# Altium schematic sheet Registers.SchDoc
size A3
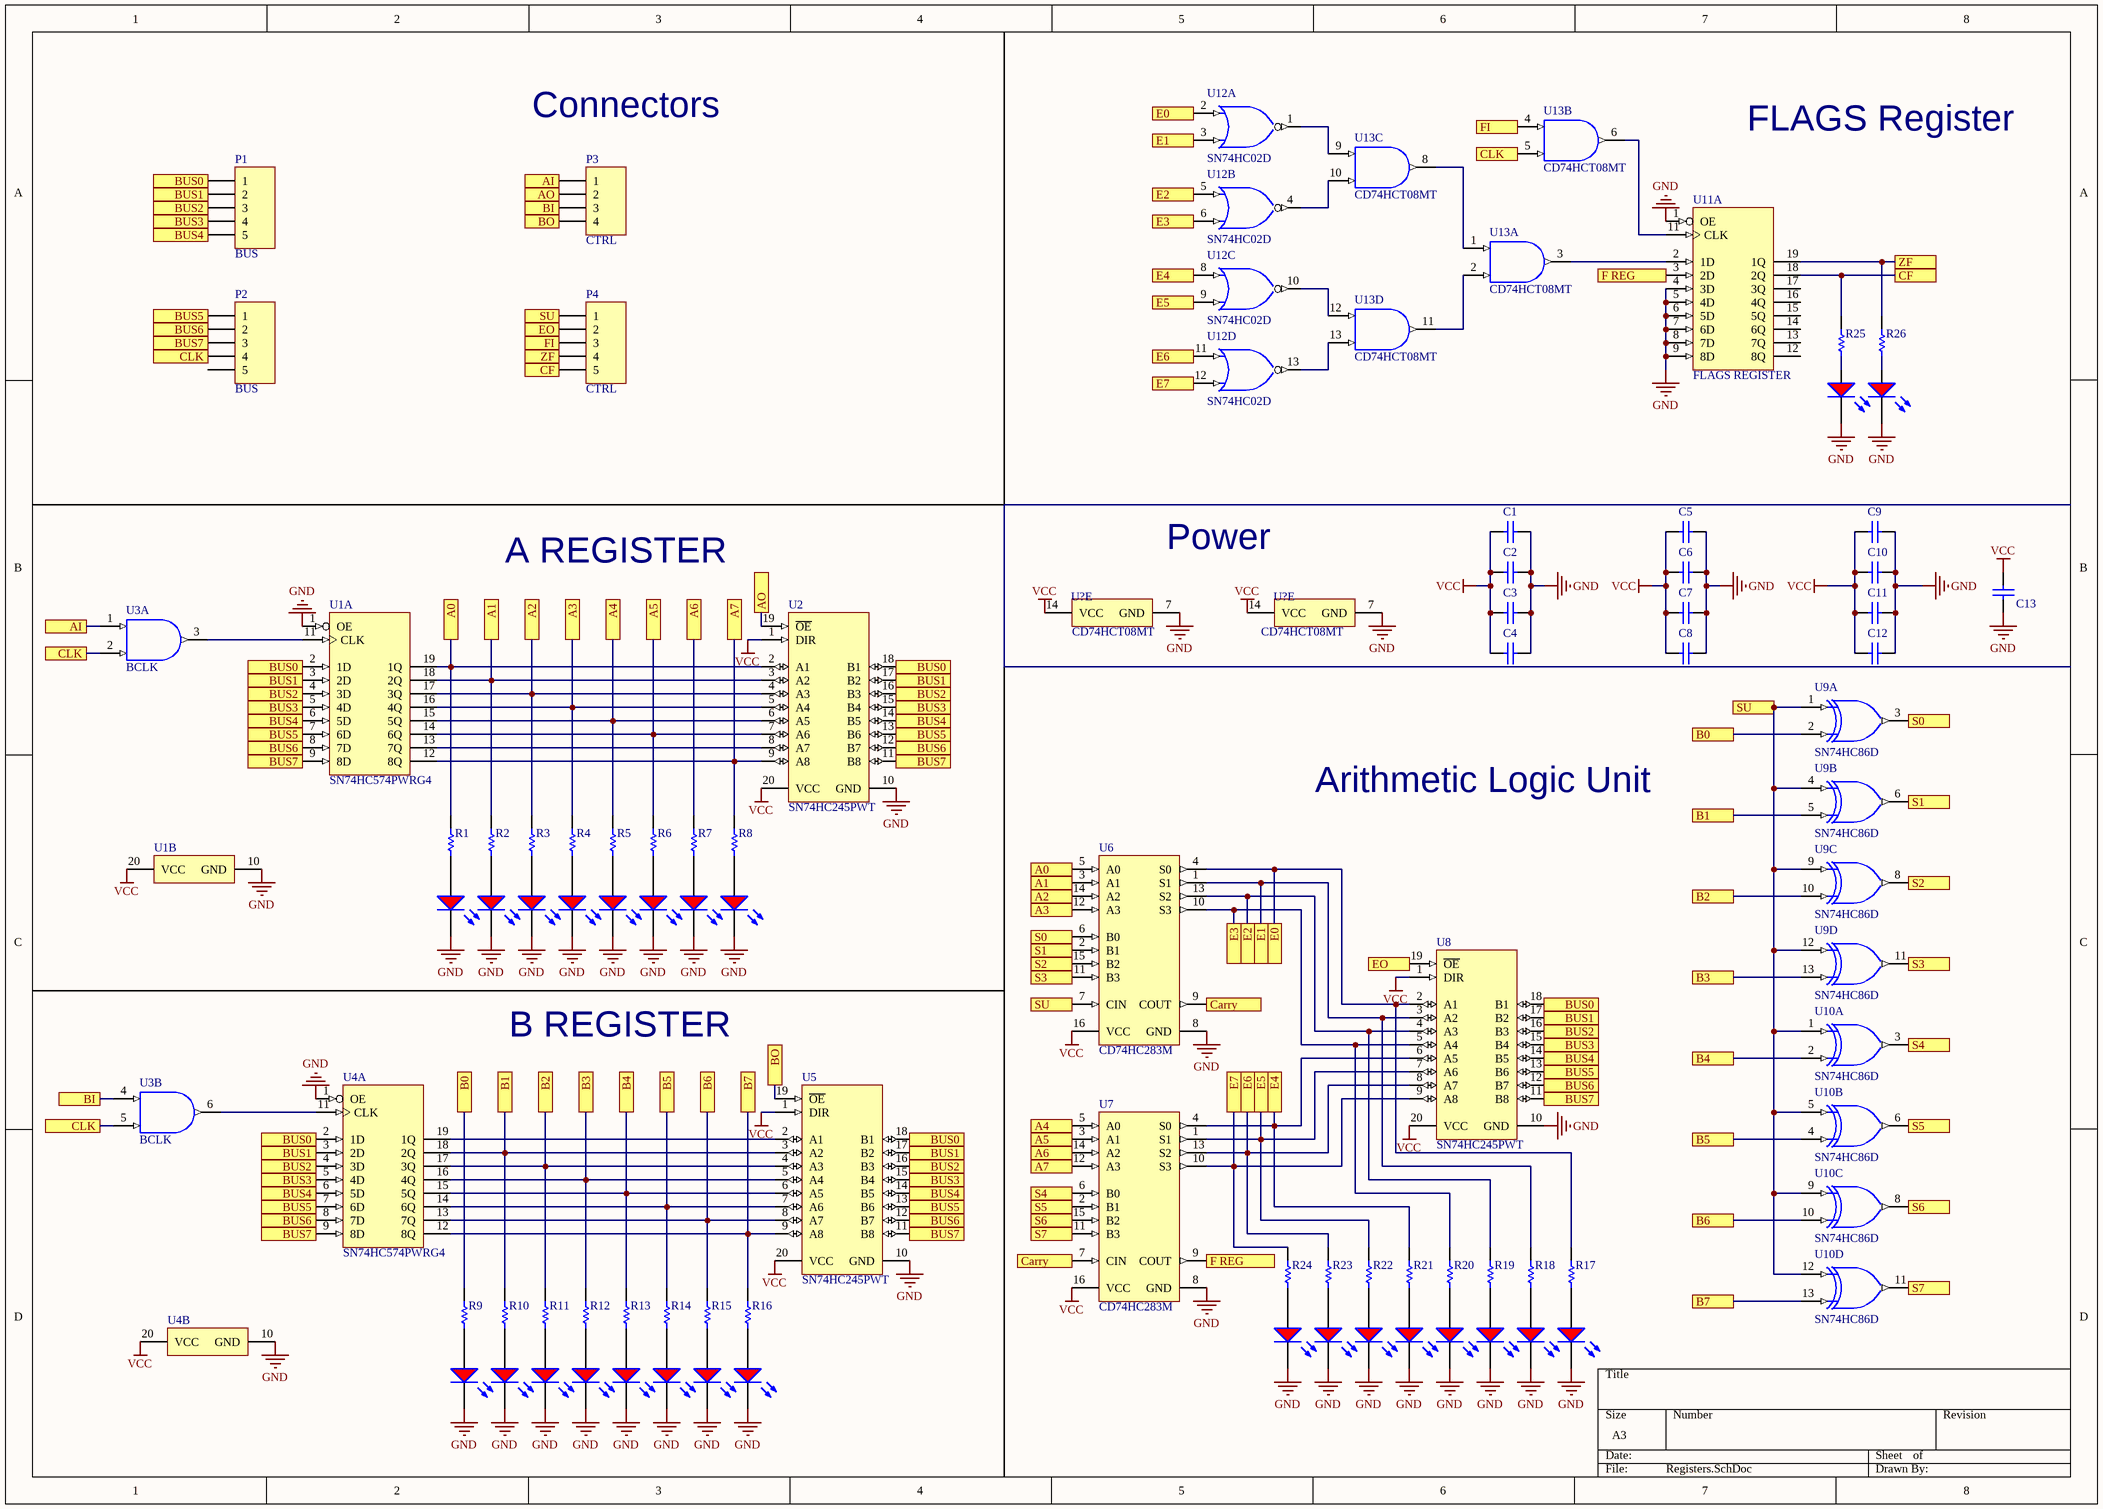
[diagram p0: Registers.SchDoc]

## Parts
(Parts that share a designator on the sheet are numbered #1, #2 ... from top to bottom, then left to right.)
C1  CAP 100nF 10V 0805(2012)  [CAPC0805(2012)100_N]  (value not drawn)
C2  CAP 100nF 10V 0805(2012)  [CAPC0805(2012)100_N]  (value not drawn)
C3  CAP 100nF 10V 0805(2012)  [CAPC0805(2012)100_N]  (value not drawn)
C4  CAP 100nF 10V 0805(2012)  [CAPC0805(2012)100_N]  (value not drawn)
C5  CAP 100nF 10V 0805(2012)  [CAPC0805(2012)100_N]  (value not drawn)
C6  CAP 100nF 10V 0805(2012)  [CAPC0805(2012)100_N]  (value not drawn)
C7  CAP 100nF 10V 0805(2012)  [CAPC0805(2012)100_N]  (value not drawn)
C8  CAP 100nF 10V 0805(2012)  [CAPC0805(2012)100_N]  (value not drawn)
C9  CAP 100nF 10V 0805(2012)  [CAPC0805(2012)100_N]  (value not drawn)
C10  CAP 100nF 10V 0805(2012)  [CAPC0805(2012)100_N]  (value not drawn)
C11  CAP 100nF 10V 0805(2012)  [CAPC0805(2012)100_N]  (value not drawn)
C12  CAP 100nF 10V 0805(2012)  [CAPC0805(2012)100_N]  (value not drawn)
C13  CAP 100nF 10V 0805(2012)  [CAPC0805(2012)100_N]  (value not drawn)
LED1  LTST-C170CKT  [LTST-C170CKT_V]  (value not drawn)
LED2  LTST-C170CKT  [LTST-C170CKT_V]  (value not drawn)
LED3  LTST-C170CKT  [LTST-C170CKT_V]  (value not drawn)
LED4  LTST-C170CKT  [LTST-C170CKT_V]  (value not drawn)
LED5  LTST-C170CKT  [LTST-C170CKT_V]  (value not drawn)
LED6  LTST-C170CKT  [LTST-C170CKT_V]  (value not drawn)
LED7  LTST-C170CKT  [LTST-C170CKT_V]  (value not drawn)
LED8  LTST-C170CKT  [LTST-C170CKT_V]  (value not drawn)
LED9  LTST-C170CKT  [LTST-C170CKT_V]  (value not drawn)
LED10  LTST-C170CKT  [LTST-C170CKT_V]  (value not drawn)
LED11  LTST-C170CKT  [LTST-C170CKT_V]  (value not drawn)
LED12  LTST-C170CKT  [LTST-C170CKT_V]  (value not drawn)
LED13  LTST-C170CKT  [LTST-C170CKT_V]  (value not drawn)
LED14  LTST-C170CKT  [LTST-C170CKT_V]  (value not drawn)
LED15  LTST-C170CKT  [LTST-C170CKT_V]  (value not drawn)
LED16  LTST-C170CKT  [LTST-C170CKT_V]  (value not drawn)
LED17  LTST-C170CKT  [LTST-C170CKT_V]  (value not drawn)
LED18  LTST-C170CKT  [LTST-C170CKT_V]  (value not drawn)
LED19  LTST-C170CKT  [LTST-C170CKT_V]  (value not drawn)
LED20  LTST-C170CKT  [LTST-C170CKT_V]  (value not drawn)
LED21  LTST-C170CKT  [LTST-C170CKT_V]  (value not drawn)
LED22  LTST-C170CKT  [LTST-C170CKT_V]  (value not drawn)
LED23  LTST-C170CKT  [LTST-C170CKT_V]  (value not drawn)
LED24  LTST-C170CKT  [LTST-C170CKT_V]  (value not drawn)
LED25  LTST-C170CKT  [LTST-C170CKT_V]  (value not drawn)
LED26  LTST-C170CKT  [LTST-C170CKT_V]  (value not drawn)
P1  BUS  [HDR1X5]
P2  BUS  [HDR1X5]
P3  CTRL  [HDR1X4]
P4  CTRL  [HDR1X5]
R1  220R 1% 0603(1608)  [RESC0603(1608)_N]  (value not drawn)
R2  220R 1% 0603(1608)  [RESC0603(1608)_N]  (value not drawn)
R3  220R 1% 0603(1608)  [RESC0603(1608)_N]  (value not drawn)
R4  220R 1% 0603(1608)  [RESC0603(1608)_N]  (value not drawn)
R5  220R 1% 0603(1608)  [RESC0603(1608)_N]  (value not drawn)
R6  220R 1% 0603(1608)  [RESC0603(1608)_N]  (value not drawn)
R7  220R 1% 0603(1608)  [RESC0603(1608)_N]  (value not drawn)
R8  220R 1% 0603(1608)  [RESC0603(1608)_N]  (value not drawn)
R9  220R 1% 0603(1608)  [RESC0603(1608)_N]  (value not drawn)
R10  220R 1% 0603(1608)  [RESC0603(1608)_N]  (value not drawn)
R11  220R 1% 0603(1608)  [RESC0603(1608)_N]  (value not drawn)
R12  220R 1% 0603(1608)  [RESC0603(1608)_N]  (value not drawn)
R13  220R 1% 0603(1608)  [RESC0603(1608)_N]  (value not drawn)
R14  220R 1% 0603(1608)  [RESC0603(1608)_N]  (value not drawn)
R15  220R 1% 0603(1608)  [RESC0603(1608)_N]  (value not drawn)
R16  220R 1% 0603(1608)  [RESC0603(1608)_N]  (value not drawn)
R17  220R 1% 0603(1608)  [RESC0603(1608)_N]  (value not drawn)
R18  220R 1% 0603(1608)  [RESC0603(1608)_N]  (value not drawn)
R19  220R 1% 0603(1608)  [RESC0603(1608)_N]  (value not drawn)
R20  220R 1% 0603(1608)  [RESC0603(1608)_N]  (value not drawn)
R21  220R 1% 0603(1608)  [RESC0603(1608)_N]  (value not drawn)
R22  220R 1% 0603(1608)  [RESC0603(1608)_N]  (value not drawn)
R23  220R 1% 0603(1608)  [RESC0603(1608)_N]  (value not drawn)
R24  220R 1% 0603(1608)  [RESC0603(1608)_N]  (value not drawn)
R25  220R 1% 0603(1608)  [RESC0603(1608)_N]  (value not drawn)
R26  220R 1% 0603(1608)  [RESC0603(1608)_N]  (value not drawn)
U1  SN74HC574PWRG4  [PW0020A_L]  (parts A,B of 2)
U2  SN74HC245PWT  [PW0020A_N]
U3  BCLK  [D0014A_N]  (parts A,B of 5)
U4  SN74HC574PWRG4  [PW0020A_L]  (parts A,B of 2)
U5  SN74HC245PWT  [PW0020A_N]
U6  CD74HC283M  [D0016A_N]
U7  CD74HC283M  [D0016A_N]
U8  SN74HC245PWT  [PW0020A_N]
U9  SN74HC86D  [D014_N]  (parts A,B,C,D of 4)
U10  SN74HC86D  [D014_N]  (parts A,B,C,D of 4)
U11  FLAGS REGISTER  [PW0020A_L]  (part A of 2)
U12  SN74HC02D  [D014_N]  (parts A,B,C,D of 4)
U13  CD74HCT08MT  [D0014A_N]  (parts A,B,C,D of 5)
U?#1  CD74HCT08MT  [D0014A_N]  (part E of 5)
U?#2  CD74HCT08MT  [D0014A_N]  (part E of 5)

## Ports
A0, A1, A2, A3, A4, A5, A6, A7, AI, AO, B0, B1, B2, B3, B4, B5, B6, B7, BI, BO, BUS0, BUS1, BUS2, BUS3, BUS4, BUS5, BUS6, BUS7, Carry, CF, CLK, E0, E1, E2, E3, E4, E5, E6, E7, EO, F REG, FI, S0, S1, S2, S3, S4, S5, S6, S7, SU, ZF

## Nets
GND: C1.2 C2.2 C3.2 C4.2 C5.2 C6.2 C7.2 C8.2 C9.2 C10.2 C11.2 C12.2 C13.2 LED1.2(K) LED2.2(K) LED3.2(K) LED4.2(K) LED5.2(K) LED6.2(K) LED7.2(K) LED8.2(K) LED9.2(K) LED10.2(K) LED11.2(K) LED12.2(K) LED13.2(K) LED14.2(K) LED15.2(K) LED16.2(K) LED17.2(K) LED18.2(K) LED19.2(K) LED20.2(K) LED21.2(K) LED22.2(K) LED23.2(K) LED24.2(K) LED25.2(K) LED26.2(K) U1.1(OE) U1.10(GND) U2.10(GND) U4.1(OE) U4.10(GND) U5.10(GND) U6.8(GND) U7.8(GND) U8.10(GND) U9.7(GND) U10.7(GND) U11.1(OE) U11.4(3D) U11.5(4D) U11.6(5D) U11.7(6D) U11.8(7D) U11.9(8D) U12.7(GND) U?#1.7(GND) U?#2.7(GND)
VCC: C1.1 C2.1 C3.1 C4.1 C5.1 C6.1 C7.1 C8.1 C9.1 C10.1 C11.1 C12.1 C13.1 U1.20(VCC) U2.1(DIR) U2.20(VCC) U4.20(VCC) U5.1(DIR) U5.20(VCC) U6.16(VCC) U7.16(VCC) U8.1(DIR) U8.20(VCC) U9.14(VCC) U10.14(VCC) U12.14(VCC) U?#1.14(VCC) U?#2.14(VCC)
A0: R1.2 U1.19(1Q) U2.2(A1) U6.5(A0) ; port A0
A1: R2.2 U1.18(2Q) U2.3(A2) U6.3(A1) ; port A1
A2: R3.2 U1.17(3Q) U2.4(A3) U6.14(A2) ; port A2
A3: R4.2 U1.16(4Q) U2.5(A4) U6.12(A3) ; port A3
A4: R5.2 U1.15(5Q) U2.6(A5) U7.5(A0) ; port A4
A5: R6.2 U1.14(6Q) U2.7(A6) U7.3(A1) ; port A5
A6: R7.2 U7.14(A2) ; port A6
A7: R8.2 U1.12(8Q) U2.9(A8) U7.12(A3) ; port A7
AI: P3.1 U3.1(1A) ; port AI
AO: P3.2 U2.19(~{OE}) ; port AO
B0: R9.2 U9.2(B) ; port B0
B1: R10.2 U4.18(2Q) U5.3(A2) U9.5(B) ; port B1
B2: R11.2 U4.17(3Q) U5.4(A3) U9.10(B) ; port B2
B3: R12.2 U4.16(4Q) U5.5(A4) U9.13(B) ; port B3
B4: R13.2 U4.15(5Q) U5.6(A5) U10.2(B) ; port B4
B5: R14.2 U4.14(6Q) U5.7(A6) U10.4(A) ; port B5
B6: R15.2 U4.13(7Q) U5.8(A7) U10.10(B) ; port B6
B7: R16.2 U4.12(8Q) U5.9(A8) U10.13(B) ; port B7
BI: P3.3 U3.4(2A) ; port BI
BO: P3.4 U5.19(~{OE}) ; port BO
BUS0: P1.1 U1.2(1D) U2.18(B1) U4.2(1D) U5.18(B1) U8.18(B1) ; port BUS0
BUS1: P1.2 U1.3(2D) U2.17(B2) U4.3(2D) U5.17(B2) U8.17(B2) ; port BUS1
BUS2: P1.3 U1.4(3D) U2.16(B3) U4.4(3D) U5.16(B3) U8.16(B3) ; port BUS2
BUS3: P1.4 U1.5(4D) U2.15(B4) U4.5(4D) U5.15(B4) U8.15(B4) ; port BUS3
BUS4: P1.5 U1.6(5D) U2.14(B5) U4.6(5D) U5.14(B5) U8.14(B5) ; port BUS4
BUS5: P2.1 U1.7(6D) U2.13(B6) U4.7(6D) U5.13(B6) U8.13(B6) ; port BUS5
BUS6: P2.2 U1.8(7D) U2.12(B7) U4.8(7D) U5.12(B7) U8.12(B7) ; port BUS6
BUS7: P2.3 U1.9(8D) U2.11(B8) U4.9(8D) U5.11(B8) U8.11(B8) ; port BUS7
Carry: U6.9(COUT) U7.7(CIN) ; port Carry
CF: P4.5 R25.2 U11.18(2Q) ; port CF
CLK: P2.4 U3.2(1B) U3.5(2B) U13.5(2B) ; port CLK
E0: R17.2 U6.4(S0) U8.2(A1) U12.2(A) ; port E0
E1: R18.2 U6.1(S1) U8.3(A2) U12.3(B) ; port E1
E2: R19.2 U6.13(S2) U8.4(A3) U12.5(A) ; port E2
E3: R20.2 U6.10(S3) U8.5(A4) U12.6(B) ; port E3
E4: R21.2 U7.4(S0) U8.6(A5) U12.8(A) ; port E4
E5: R22.2 U7.1(S1) U8.7(A6) U12.9(B) ; port E5
E6: R23.2 U7.13(S2) U8.8(A7) U12.11(A) ; port E6
E7: R24.2 U7.10(S3) U8.9(A8) U12.12(B) ; port E7
EO: P4.2 U8.19(~{OE}) ; port EO
F REG: U7.9(COUT) U11.3(2D) ; port F REG
FI: P4.3 U13.4(2A) ; port FI
S0: U6.6(B0) U9.3(Y) ; port S0
S1: U6.2(B1) U9.6(Y) ; port S1
S2: U6.15(B2) U9.8(Y) ; port S2
S3: U6.11(B3) U9.11(Y) ; port S3
S4: U7.6(B0) U10.3(Y) ; port S4
S5: U7.2(B1) U10.6(Y) ; port S5
S6: U7.15(B2) U10.8(Y) ; port S6
S7: U7.11(B3) U10.11(Y) ; port S7
SU: P4.1 U6.7(CIN) U9.1(A) U9.4(A) U9.9(A) U9.12(A) U10.1(A) U10.5(B) U10.9(A) U10.12(A) ; port SU
ZF: P4.4 R26.2 U11.19(1Q) ; port ZF
NetLED1_1: LED1.1(A) R1.1
NetLED2_1: LED2.1(A) R2.1
NetLED3_1: LED3.1(A) R3.1
NetLED4_1: LED4.1(A) R4.1
NetLED5_1: LED5.1(A) R5.1
NetLED6_1: LED6.1(A) R6.1
NetLED7_1: LED7.1(A) R7.1
NetLED8_1: LED8.1(A) R8.1
NetLED9_1: LED9.1(A) R9.1
NetLED10_1: LED10.1(A) R10.1
NetLED11_1: LED11.1(A) R11.1
NetLED12_1: LED12.1(A) R12.1
NetLED13_1: LED13.1(A) R13.1
NetLED14_1: LED14.1(A) R14.1
NetLED15_1: LED15.1(A) R15.1
NetLED16_1: LED16.1(A) R16.1
NetLED17_1: LED17.1(A) R17.1
NetLED18_1: LED18.1(A) R18.1
NetLED19_1: LED19.1(A) R19.1
NetLED20_1: LED20.1(A) R20.1
NetLED21_1: LED21.1(A) R21.1
NetLED22_1: LED22.1(A) R22.1
NetLED23_1: LED23.1(A) R23.1
NetLED24_1: LED24.1(A) R24.1
NetLED25_1: LED25.1(A) R25.1
NetLED26_1: LED26.1(A) R26.1
NetU1_11: U1.11(CLK) U3.3(1Y)
NetU1_13: U1.13(7Q) U2.8(A7)
NetU3_6: U3.6(2Y) U4.11(CLK)
NetU4_19: U4.19(1Q) U5.2(A1)
NetU11_2: U11.2(1D) U13.3(1Y)
NetU11_11: U11.11(CLK) U13.6(2Y)
NetU12_1: U12.1(Y) U13.9(3A)
NetU12_4: U12.4(Y) U13.10(3B)
NetU12_10: U12.10(Y) U13.12(4A)
NetU12_13: U12.13(Y) U13.13(4B)
NetU13_1: U13.1(1A) U13.8(3Y)
NetU13_2: U13.2(1B) U13.11(4Y)

Not connected (* = marked no-connect by the designer): P2 5; U11 12(8Q) 13(7Q) 14(6Q) 15(5Q) 16(4Q) 17(3Q)

## Notes on the sheet
- Connectors
- FLAGS Register
- A REGISTER
- Power
- Arithmetic Logic Unit
- B REGISTER

## Library data of the parts
C1-C13 = CMP-1036-04398-1: CAP 100nF 10V -20% to +80% 0805 (2012 Metric) Thickness 1mm SMD; Case-Metric: 2012; Case-EIA: 0805; Rated Voltage: 10 V; Max Thickness: 1 mm; Technology: SMT; Tolerance: -20% to +80%; Value: 100nF
LED1-LED26 = CMP-1674-00001-5: LED Uni-Color Red, 100 mW, 200 mA, -55 to 85 degC, 2-Pin SMD, RoHS, Tape and Reel; Manufacturer: Lite-On; ComponentLink1Description: Manufacturer URL; PackageReference: C170CKT; Package Quantity: 3000; Packaging: Tape and Reel; Pins: 2; ComponentLink2URL: http://media.digikey.com/pdf/Data%20Sheets/Lite-On%20PDFs/LTST-C170CKT.pdf; Max Operating Temperature: 85 degC; Min Operating Temperature: -55 degC; ComponentLink1URL: http://www.us.liteon.com/; Mounting Technology: Surface Mount; Mount: Surface Mount; Length: 2 mm; ComponentLink2Description: Datasheet; DatasheetVersion: 03/2003; Height: 1.1 mm; PackageDescription: 2-Pin Surface Mount Device, Body 2 x 1.25 mm; RoHSCompliant: true; Colour: Red
P1 P2 = Header 5: Header, 5-Pin; LatestRevisionDate: 17-Jul-2002; LatestRevisionNote: Re-released for DXP Platform.; Publisher: Altium Limited
P3 = Header 4: Header, 4-Pin; LatestRevisionDate: 17-Jul-2002; LatestRevisionNote: Re-released for DXP Platform.; Publisher: Altium Limited
P4 = Header 5H: Header, 5-Pin, Right Angle; LatestRevisionDate: 17-Jul-2002; LatestRevisionNote: Re-released for DXP Platform.; Publisher: Altium Limited
R1-R26 = CMP-1012-00433-1: 220R 0.1W 1% 0603 (1608 Metric)  SMD; Value: 220.00 Ohm; Case-EIA: 0603; Case-Metric: 1608; Technology: SMT; Tolerance: 1 %; Power: 0.1 W
U1 U4 = CMP-1619-01050-2: Octal Edge-Triggered D-Type Flip-Flops With 3-State Outputs, PW0020A, LARGE T&R; Manufacturer: Texas Instruments; Output Type: CMOS; ICC @ Nom Voltage(Max)(mA): 0.08; Technology Family: HC; VCC(Min)(V): 2; tpd @ Nom Voltage(Max)(ns): 38; Schmitt Trigger: No; Bits(#): 8; Rating: Catalog; Output Logic: Non-inverted; VCC(Max)(V): 6; Voltage(Nom)(V): 3.3,5; Output Drive (IOL/IOH)(Max)(mA): 7.8/-7.8; 3-State Output: Yes; F @ Nom Voltage(Max)(Mhz): 28; Input Type: CMOS; DatasheetVersion: SCLS148F; PackageReference: PW0020A; Code_JEDEC: MO-153; Generic Part Number: SN74HC574; Operating Temperature Range(C): -40 to 85
U2 U5 U8 = CMP-1620-00532-2: Octal Bus Transceivers With 3-State Outputs, PW0020A, SMALL T&R; Manufacturer: Texas Instruments; VCC(Min)(V): 2; Schmitt Trigger: No; Input Type: CMOS; VCC(Max)(V): 6; Technology Family: HC; Rating: Catalog; Output Drive (IOL/IOH)(Max)(mA): -6/6; Bits(#): 8; ICC @ Nom Voltage(Max)(mA): 0.08; tpd @ Nom Voltage(Max)(ns): 22; F @ Nom Voltage(Max)(Mhz): 28; Code_JEDEC: MO-153; Output Type: CMOS; DatasheetVersion: SCLS131D; Operating Temperature Range(C): -40 to 85; Voltage(Nom)(V): 6; PackageReference: PW0020A; Generic Part Number: SN74HC245
U3 = CMP-0777-00117-3: High Speed CMOS Logic Quad 2-Input AND Gates, D0014A, SMALL T&R; Generic Part Number: CD74HCT08; Manufacturer: Texas Instruments; VCC(Max)(V): 5.5; Voltage(Nom)(V): 5; Bits(#): 4; Technology Family: HCT; Rating: Catalog; ICC @ Nom Voltage(Max)(mA): 0.02; Output Drive (IOL/IOH)(Max)(mA): -5.2/5.2; tpd @ Nom Voltage(Max)(ns): 31; Schmitt Trigger: No; F @ Nom Voltage(Max)(Mhz): 25; VCC(Min)(V): 4.5; Input Type: TTL; PackageReference: D0014A; DatasheetVersion: SCHS118C; Output Type: CMOS; Operating Temperature Range(C): -55 to 125
U6 U7 = CMP-1623-00133-1: High Speed CMOS Logic 4-Bit Binary Full Adder with Fast Carry, D0016A, TUBE; Manufacturer: Texas Instruments; F @ Nom Voltage(Max)(Mhz): 28; Rating: Catalog; VCC(Min)(V): 2; Input Type: LVTTL/CMOS; Bits(#): 4; tpd @ Nom Voltage(Max)(ns): 42; Inputs: 9; Function: Arithmetic; Voltage(Nom)(V): 3.3,5; Output Drive (IOL/IOH)(Max)(mA): 5.2/-5.2; Schmitt Trigger: No; Technology Family: HC; ICC @ Nom Voltage(Max)(mA): 0.08; VCC(Max)(V): 6; ComponentLink1URL: http://www.ti.com/; ComponentLink3URL: http://www.ti.com/lit/ml/mpds178g/mpds178g.pdf; ComponentLink1Description: Manufacturer URL; ComponentLink2URL: http://www.ti.com/lit/ds/symlink/cd74hc283.pdf; Output Type: CMOS; PackageReference: D0016A; Operating Temperature Range(C): -55 to 125; PartNumber: CD74HC283M; Generic Part Number: CD74HC283; ComponentLink2Description: Datasheet; ComponentLink3Description: Package Specification; Type: Binary; DatasheetVersion: SCHS176D; Code_JEDEC: MS-012 variation AC
U9 U10 = SN74HC86D: Quadruple 2-Input Exclusive-OR Gate; Published: 8-Jun-2000; LatestRevisionDate: 13-Apr-2006; LatestRevisionNote: IPC-7351 Footprint Added.; DatasheetVersion: Aug-1999; PackageVersion: Jan-1998; PackageReference: D014; Publisher: Altium Limited; PackageDescription: 14-Pin Small Outline Integrated Circuit 1.27 mm Pitch; Code_IPC: SOIC127P600-14; ComponentLink1Description: Manufacturer Link; ComponentLink1URL: http://www.ti.com/; ComponentLink2Description: Datasheet; ComponentLink2URL: http://www-s.ti.com/sc/ds/SN54HC86.pdf
U11 = CMP-1619-01050-2: Octal Edge-Triggered D-Type Flip-Flops With 3-State Outputs, PW0020A, LARGE T&R; Generic Part Number: SN74HC574; Manufacturer: Texas Instruments; Output Type: CMOS; ICC @ Nom Voltage(Max)(mA): 0.08; Technology Family: HC; VCC(Min)(V): 2; tpd @ Nom Voltage(Max)(ns): 38; Schmitt Trigger: No; Bits(#): 8; Rating: Catalog; Output Logic: Non-inverted; VCC(Max)(V): 6; Voltage(Nom)(V): 3.3,5; Output Drive (IOL/IOH)(Max)(mA): 7.8/-7.8; 3-State Output: Yes; F @ Nom Voltage(Max)(Mhz): 28; Input Type: CMOS; DatasheetVersion: SCLS148F; PackageReference: PW0020A; Code_JEDEC: MO-153; Operating Temperature Range(C): -40 to 85
U12 = SN74HC02D: Quadruple 2-Input Positive-NOR Gate; Published: 8-Jun-2000; LatestRevisionDate: 13-Apr-2006; LatestRevisionNote: IPC-7351 Footprint Added.; DatasheetVersion: May-1997; PackageVersion: Jan-1998; PackageReference: D014; Publisher: Altium Limited; PackageDescription: 14-Pin Small Outline Integrated Circuit 1.27 mm Pitch; Code_IPC: SOIC127P600-14; ComponentLink1Description: Manufacturer Link; ComponentLink1URL: http://www.ti.com/; ComponentLink2Description: Datasheet; ComponentLink2URL: http://www-s.ti.com/sc/ds/sn74hc02.pdf
U13 U?#1 U?#2 = CMP-0777-00117-3: High Speed CMOS Logic Quad 2-Input AND Gates, D0014A, SMALL T&R; Manufacturer: Texas Instruments; VCC(Max)(V): 5.5; Voltage(Nom)(V): 5; Bits(#): 4; Technology Family: HCT; Rating: Catalog; ICC @ Nom Voltage(Max)(mA): 0.02; Output Drive (IOL/IOH)(Max)(mA): -5.2/5.2; tpd @ Nom Voltage(Max)(ns): 31; Schmitt Trigger: No; F @ Nom Voltage(Max)(Mhz): 25; VCC(Min)(V): 4.5; Input Type: TTL; PackageReference: D0014A; Generic Part Number: CD74HCT08; DatasheetVersion: SCHS118C; Output Type: CMOS; Operating Temperature Range(C): -55 to 125